# EAGLE schematic Philter (EAGLE 7.5.0)
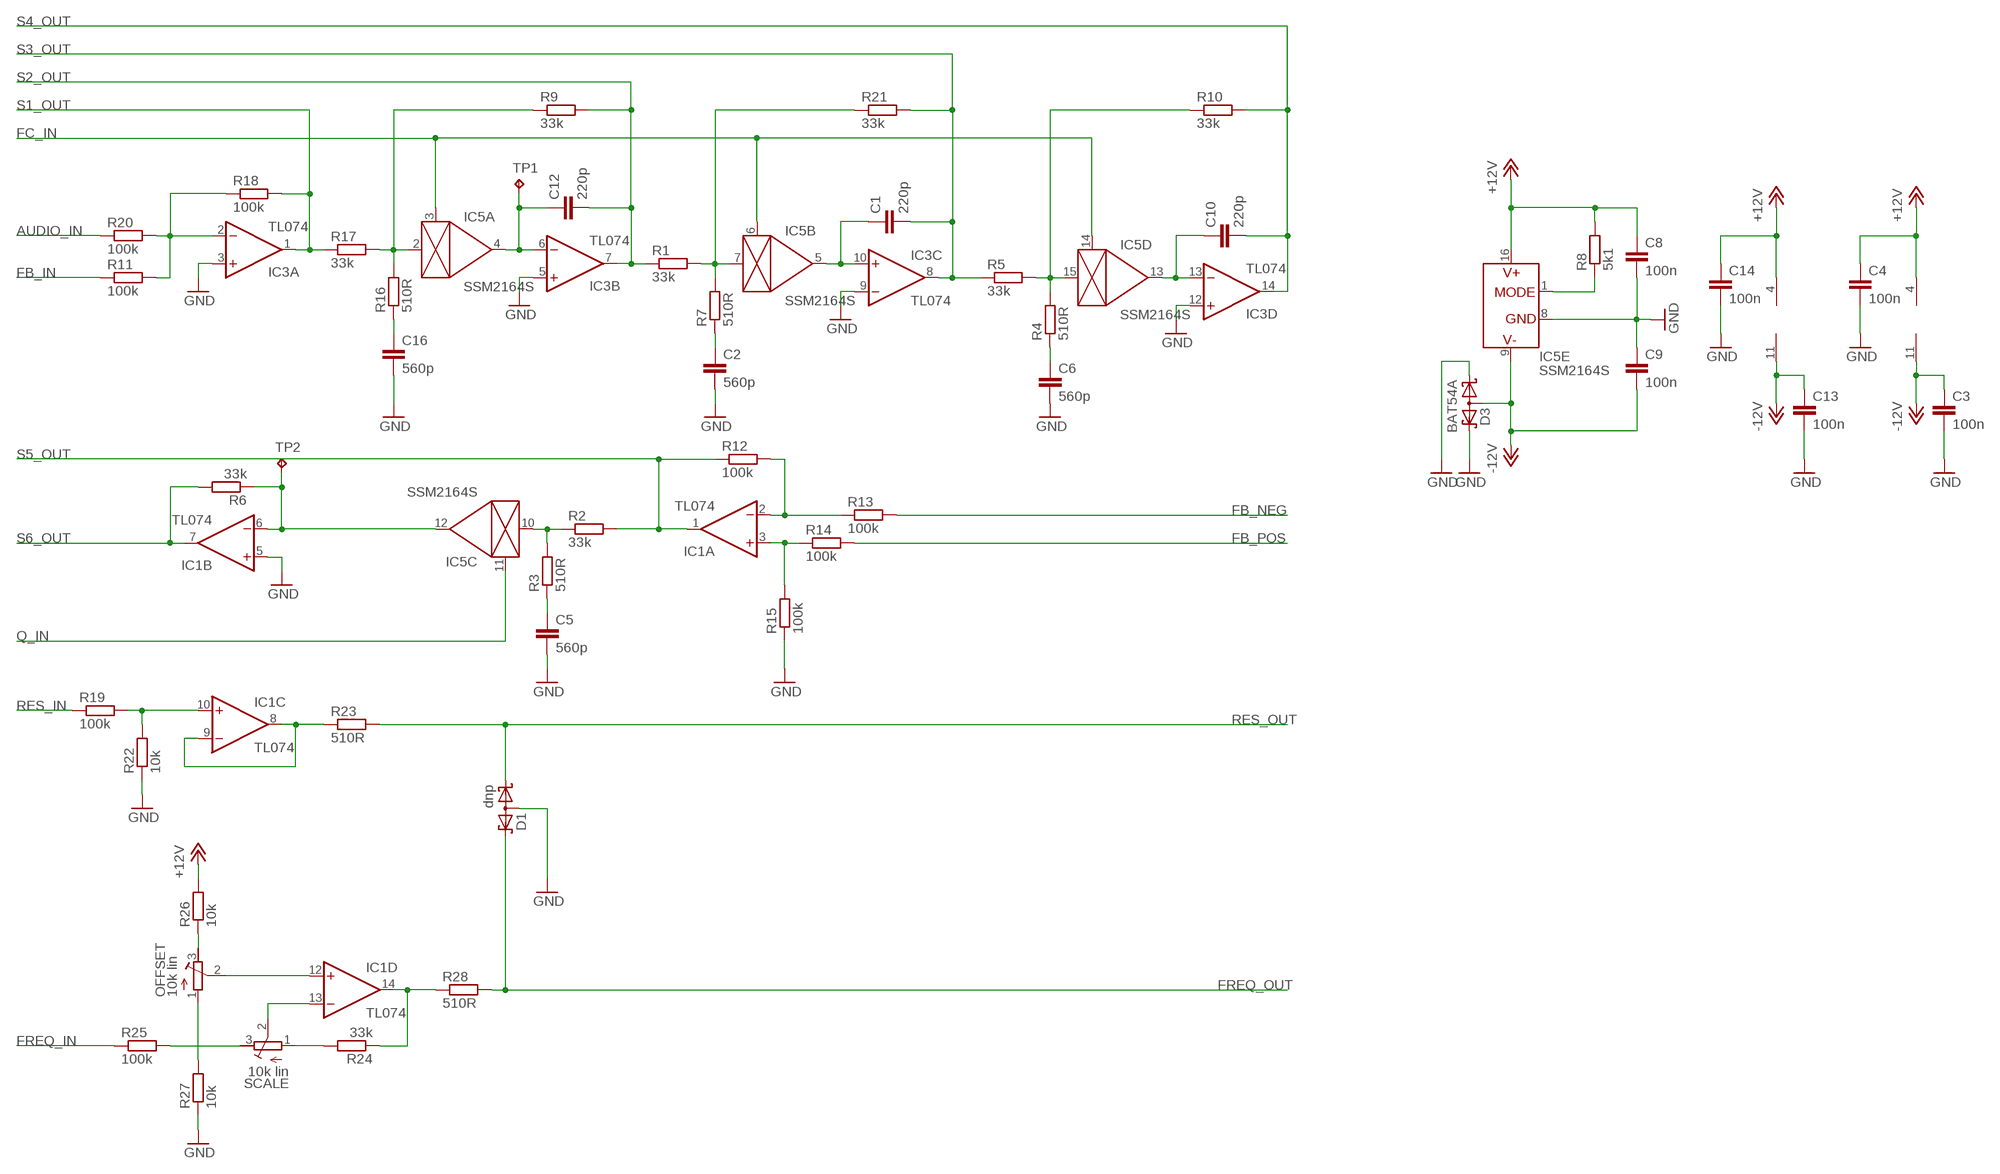
[diagram p0: schematic, sheet 1]

## Parts
C1  220p  C-EUC0603  [C0603]
C2  560p  C-EUC0603  [C0603]
C3  100n  C-EUC0603K  [C0603K]
C4  100n  C-EUC0603K  [C0603K]
C5  560p  C-EUC0603  [C0603]
C6  560p  C-EUC0603  [C0603]
C8  100n  C-EUC0603K  [C0603K]
C9  100n  C-EUC0603K  [C0603K]
C10  220p  C-EUC0603  [C0603]
C12  220p  C-EUC0603  [C0603]
C13  100n  C-EUC0603K  [C0603K]
C14  100n  C-EUC0603K  [C0603K]
C16  560p  C-EUC0603  [C0603]
D1  dnp  BAT54A  [SOT23]
D3  BAT54A  [SOT23]
IC1  TL074  TL074D  [SO14]
IC3  TL074  TL074D  [SO14]
IC5  SSM2164S  [SOIC16N]
OFFSET  10k lin  R-TRIMM64W  [RTRIM64W]
R1  33k  R-EU_0603  [0603]
R2  33k  R-EU_0603  [0603]
R3  510R  R-EU_0603  [0603]
R4  510R  R-EU_0603  [0603]
R5  33k  R-EU_0603  [0603]
R6  33k  R-EU_0603  [0603]
R7  510R  R-EU_0603  [0603]
R8  5k1  R-EU_0603  [0603]
R9  33k  R-EU_0603  [0603]
R10  33k  R-EU_0603  [0603]
R11  100k  R-EU_0603  [0603]
R12  100k  R-EU_0603  [0603]
R13  100k  R-EU_0603  [0603]
R14  100k  R-EU_0603  [0603]
R15  100k  R-EU_0603  [0603]
R16  510R  R-EU_0603  [0603]
R17  33k  R-EU_0603  [0603]
R18  100k  R-EU_0603  [0603]
R19  100k  R-EU_0603  [0603]
R20  100k  R-EU_0603  [0603]
R21  33k  R-EU_0603  [0603]
R22  10k  R-EU_0603  [0603]
R23  510R  R-EU_0603  [0603]
R24  33k  R-EU_0603  [0603]
R25  100k  R-EU_0603  [0603]
R26  10k  R-EU_0603  [0603]
R27  10k  R-EU_0603  [0603]
R28  510R  R-EU_0603  [0603]
SCALE  10k lin  R-TRIMM64W  [RTRIM64W]
TP1  TPPAD1-13  [P1-13]
TP2  TPPAD1-13  [P1-13]

## Nets
+12V: C4.1 C8.1 C14.1 IC1.4(P:V+) IC3.4(P:V+) IC5.16(E:V+) R8.2 R26.2
-12V: C3.1 C9.2 C13.1 D3.3(AA) IC1.11(P:V-) IC3.11(P:V-) IC5.9(E:V-)
AUDIO_IN: R20.1
FB_IN: R11.1
FB_NEG: R13.2
FB_POS: R14.2
FC_IN: IC5.3(A:CTRL) IC5.6(B:CTRL) IC5.14(D:CTRL)
FREQ_IN: R25.1
FREQ_OUT: D1.2(K2) R28.2
GND: C2.2 C3.2 C4.2 C5.2 C6.2 C8.2 C9.1 C13.2 C14.2 C16.2 D1.3(AA) D3.1(K1) D3.2(K2) IC1.5(B:+IN) IC3.3(A:+IN) IC3.5(B:+IN) IC3.9(C:-IN) IC3.12(D:+IN) IC5.8(E:GND) R15.1 R22.1 R27.1
N$1: IC5.1(E:MODE) R8.1
N$2: IC5.7(B:IN) R1.2 R7.2 R21.1
N$4: C2.1 R7.1
N$5: C1.1 IC3.10(C:+IN) IC5.5(B:OUT)
N$6: IC1.3(A:+IN) R14.1 R15.2
N$7: IC1.2(A:-IN) R12.2 R13.1
N$8: IC1.6(B:-IN) IC5.12(C:OUT) R6.1 TP2.TP
N$9: IC1.10(C:+IN) R19.2 R22.2
N$10: IC1.8(C:OUT) IC1.9(C:-IN) R23.1
N$11: IC1.13(D:-IN) SCALE.2(S)
N$12: IC3.2(A:-IN) R11.2 R18.1 R20.2
N$13: IC1.12(D:+IN) OFFSET.2(S)
N$14: R25.2 SCALE.3(E)
N$15: OFFSET.1(A) R27.2
N$16: OFFSET.3(E) R26.1
N$17: C6.1 R4.1
N$19: C12.1 IC3.6(B:-IN) IC5.4(A:OUT) TP1.TP
N$20: R24.2 SCALE.1(A)
N$21: IC5.10(C:IN) R2.1 R3.2
N$22: IC1.14(D:OUT) R24.1 R28.1
N$26: IC5.15(D:IN) R4.2 R5.2 R10.1
N$27: C5.1 R3.1
N$28: C10.1 IC3.13(D:-IN) IC5.13(D:OUT)
N$29: IC5.2(A:IN) R9.1 R16.2 R17.2
N$30: C16.1 R16.1
Q_IN: IC5.11(C:CTRL)
RES_IN: R19.1
RES_OUT: D1.1(K1) R23.2
S1_OUT: IC3.1(A:OUT) R17.1 R18.2
S2_OUT: C12.2 IC3.7(B:OUT) R1.1 R9.2
S3_OUT: C1.2 IC3.8(C:OUT) R5.1 R21.2
S4_OUT: C10.2 IC3.14(D:OUT) R10.2
S5_OUT: IC1.1(A:OUT) R2.2 R12.1
S6_OUT: IC1.7(B:OUT) R6.2

## Library data of the parts
C1-C6 C8-C10 C12-C14 C16 = Rebel:C-EU: CAPACITOR, European symbol
D1 D3 = diode:BAT54A: Schottky Diodes Source: Fairchild .. BAT54.pdf
IC1 IC3 = linear:TL074: OP AMP
IC5 = ssm2164:SSM2164
OFFSET SCALE = resistor:R-TRIMM: Trimm resistor
R1-R28 = Rebel:R-EU_: RESISTOR, European symbol
TP1 TP2 = testpad:TP: Test pad